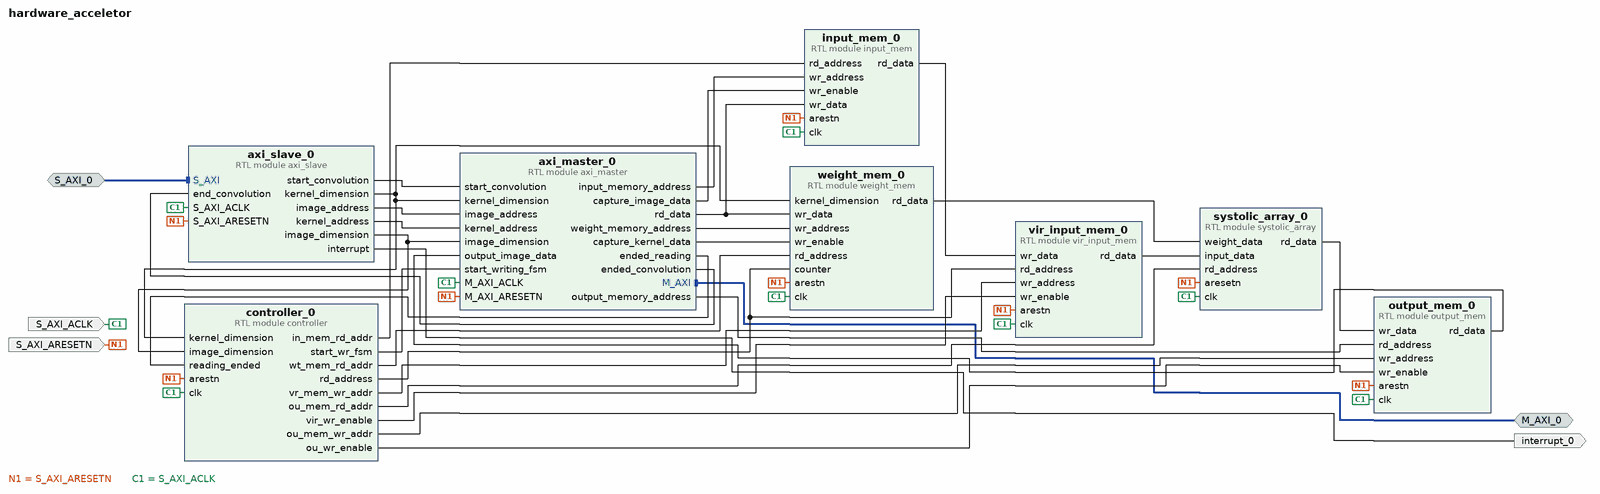
[diagram p0: block diagram of the top level]
# Vivado block design hardware_acceletor, xczu7ev-ffvc1156-2-e, Vivado 2018.3
create_bd_design hardware_acceletor

create_bd_intf_port -mode Slave -vlnv xilinx.com:interface:aximm_rtl:1.0 S_AXI_0
set_property -dict [list \
  CONFIG.ADDR_WIDTH 12 \
  CONFIG.ARUSER_WIDTH 0 \
  CONFIG.AWUSER_WIDTH 0 \
  CONFIG.BUSER_WIDTH 0 \
  CONFIG.DATA_WIDTH 32 \
  CONFIG.HAS_BRESP 1 \
  CONFIG.HAS_BURST 0 \
  CONFIG.HAS_CACHE 0 \
  CONFIG.HAS_LOCK 0 \
  CONFIG.HAS_PROT 1 \
  CONFIG.HAS_QOS 0 \
  CONFIG.HAS_REGION 0 \
  CONFIG.HAS_RRESP 1 \
  CONFIG.HAS_WSTRB 1 \
  CONFIG.ID_WIDTH 0 \
  CONFIG.MAX_BURST_LENGTH 1 \
  CONFIG.NUM_READ_OUTSTANDING 1 \
  CONFIG.NUM_READ_THREADS 1 \
  CONFIG.NUM_WRITE_OUTSTANDING 1 \
  CONFIG.NUM_WRITE_THREADS 1 \
  CONFIG.PROTOCOL AXI4LITE \
  CONFIG.READ_WRITE_MODE READ_WRITE \
  CONFIG.RUSER_BITS_PER_BYTE 0 \
  CONFIG.RUSER_WIDTH 0 \
  CONFIG.SUPPORTS_NARROW_BURST 0 \
  CONFIG.WUSER_BITS_PER_BYTE 0 \
  CONFIG.WUSER_WIDTH 0 \
] [get_bd_intf_ports S_AXI_0]
create_bd_intf_port -mode Master -vlnv xilinx.com:interface:aximm_rtl:1.0 M_AXI_0
set_property -dict [list \
  CONFIG.ADDR_WIDTH 32 \
  CONFIG.DATA_WIDTH 32 \
  CONFIG.HAS_BURST 0 \
  CONFIG.HAS_CACHE 0 \
  CONFIG.HAS_LOCK 0 \
  CONFIG.HAS_QOS 0 \
  CONFIG.HAS_REGION 0 \
  CONFIG.PROTOCOL AXI4LITE \
] [get_bd_intf_ports M_AXI_0]
create_bd_port -dir I -type clk S_AXI_ACLK
set_property -dict {CONFIG.FREQ_HZ 100000000} [get_bd_ports S_AXI_ACLK]
create_bd_port -dir I -type rst S_AXI_ARESETN
create_bd_port -dir O -type intr interrupt_0

create_bd_cell -type module -reference axi_slave axi_slave_0
create_bd_cell -type module -reference input_mem input_mem_0
create_bd_cell -type module -reference output_mem output_mem_0
create_bd_cell -type module -reference vir_input_mem vir_input_mem_0
create_bd_cell -type module -reference weight_mem weight_mem_0
create_bd_cell -type module -reference systolic_array systolic_array_0
create_bd_cell -type module -reference controller controller_0
create_bd_cell -type module -reference axi_master axi_master_0

# ---- connections ----

connect_bd_intf_net -intf_net S_AXI_0_1 [get_bd_intf_ports S_AXI_0] [get_bd_intf_pins axi_slave_0/S_AXI]
connect_bd_intf_net [get_bd_intf_ports M_AXI_0] [get_bd_intf_pins axi_master_0/M_AXI]
connect_bd_net [get_bd_pins axi_slave_0/start_convolution] [get_bd_pins axi_master_0/start_convolution]
connect_bd_net [get_bd_pins axi_slave_0/image_address] [get_bd_pins axi_master_0/image_address]
connect_bd_net [get_bd_pins axi_slave_0/image_dimension] [get_bd_pins controller_0/image_dimension] [get_bd_pins axi_master_0/image_dimension]
connect_bd_net [get_bd_pins axi_slave_0/kernel_dimension] \
  [get_bd_pins weight_mem_0/kernel_dimension] [get_bd_pins controller_0/kernel_dimension] \
  [get_bd_pins axi_master_0/kernel_dimension]
connect_bd_net [get_bd_ports S_AXI_ARESETN] \
  [get_bd_pins axi_slave_0/S_AXI_ARESETN] [get_bd_pins input_mem_0/arestn] [get_bd_pins output_mem_0/arestn] \
  [get_bd_pins vir_input_mem_0/arestn] [get_bd_pins weight_mem_0/arestn] [get_bd_pins systolic_array_0/aresetn] \
  [get_bd_pins controller_0/arestn] [get_bd_pins axi_master_0/M_AXI_ARESETN]
connect_bd_net [get_bd_ports S_AXI_ACLK] \
  [get_bd_pins axi_slave_0/S_AXI_ACLK] [get_bd_pins output_mem_0/clk] [get_bd_pins input_mem_0/clk] \
  [get_bd_pins vir_input_mem_0/clk] [get_bd_pins weight_mem_0/clk] [get_bd_pins systolic_array_0/clk] \
  [get_bd_pins controller_0/clk] [get_bd_pins axi_master_0/M_AXI_ACLK]
connect_bd_net [get_bd_pins axi_master_0/input_memory_address] [get_bd_pins input_mem_0/wr_address]
connect_bd_net [get_bd_pins axi_master_0/weight_memory_address] [get_bd_pins weight_mem_0/wr_address]
connect_bd_net [get_bd_pins axi_master_0/output_memory_address] [get_bd_pins output_mem_0/rd_address]
connect_bd_net [get_bd_pins axi_master_0/capture_image_data] [get_bd_pins input_mem_0/wr_enable]
connect_bd_net [get_bd_pins axi_master_0/capture_kernel_data] [get_bd_pins weight_mem_0/wr_enable]
connect_bd_net [get_bd_pins axi_master_0/ended_reading] [get_bd_pins controller_0/reading_ended]
connect_bd_net [get_bd_pins controller_0/in_mem_rd_addr] [get_bd_pins input_mem_0/rd_address]
connect_bd_net [get_bd_pins controller_0/wt_mem_rd_addr] [get_bd_pins weight_mem_0/rd_address]
connect_bd_net [get_bd_pins controller_0/vr_mem_wr_addr] [get_bd_pins vir_input_mem_0/wr_address]
connect_bd_net [get_bd_pins controller_0/ou_mem_rd_addr] [get_bd_pins systolic_array_0/rd_address]
connect_bd_net [get_bd_pins controller_0/ou_mem_wr_addr] [get_bd_pins output_mem_0/wr_address]
connect_bd_net [get_bd_pins controller_0/vir_wr_enable] [get_bd_pins vir_input_mem_0/wr_enable]
connect_bd_net [get_bd_pins controller_0/start_wr_fsm] [get_bd_pins axi_master_0/start_writing_fsm]
connect_bd_net [get_bd_pins controller_0/ou_wr_enable] [get_bd_pins output_mem_0/wr_enable]
connect_bd_net [get_bd_pins systolic_array_0/rd_data] [get_bd_pins output_mem_0/wr_data]
connect_bd_net [get_bd_pins vir_input_mem_0/rd_data] [get_bd_pins systolic_array_0/input_data]
connect_bd_net [get_bd_pins weight_mem_0/rd_data] [get_bd_pins systolic_array_0/weight_data]
connect_bd_net [get_bd_pins output_mem_0/rd_data] [get_bd_pins axi_master_0/output_image_data]
connect_bd_net [get_bd_pins input_mem_0/rd_data] [get_bd_pins vir_input_mem_0/wr_data]
connect_bd_net [get_bd_pins controller_0/rd_address] [get_bd_pins vir_input_mem_0/rd_address] [get_bd_pins weight_mem_0/counter]
connect_bd_net [get_bd_pins axi_master_0/ended_convolution] [get_bd_pins axi_slave_0/end_convolution]
connect_bd_net [get_bd_pins axi_slave_0/interrupt] [get_bd_ports interrupt_0]
connect_bd_net [get_bd_pins axi_slave_0/kernel_address] [get_bd_pins axi_master_0/kernel_address]
connect_bd_net [get_bd_pins axi_master_0/rd_data] [get_bd_pins weight_mem_0/wr_data] [get_bd_pins input_mem_0/wr_data]

# ---- address map ----
assign_bd_address -offset 0x44A00000 -range 128K -target_address_space [get_bd_addr_spaces axi_master_0/M_AXI] [get_bd_addr_segs M_AXI_0/Reg]
assign_bd_address -offset 0x000 -range 4K -target_address_space [get_bd_addr_spaces S_AXI_0] [get_bd_addr_segs axi_slave_0/S_AXI/reg0]

validate_bd_design
save_bd_design
